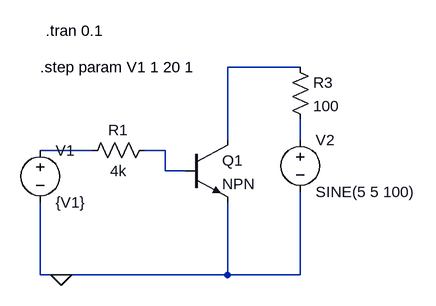
[diagram p0: schematic Draft17.asc]
Draft17.asc, the LTspice schematic file:
Version 4
SHEET 1 880 680
WIRE 576 144 464 144
WIRE 464 256 464 144
WIRE 576 256 576 224
WIRE 256 272 176 272
WIRE 368 272 336 272
WIRE 368 304 368 272
WIRE 400 304 368 304
WIRE 176 464 176 352
WIRE 208 464 176 464
WIRE 464 464 464 352
WIRE 464 464 208 464
WIRE 576 464 576 336
WIRE 576 464 464 464
FLAG 208 464 0
SYMBOL voltage 176 256 R0
SYMATTR InstName V1
SYMATTR Value {V1}
SYMBOL res 352 256 R90
WINDOW 0 0 56 VBottom 2
WINDOW 3 32 56 VTop 2
SYMATTR InstName R1
SYMATTR Value 4k
SYMBOL voltage 576 240 R0
SYMATTR InstName V2
SYMATTR Value SINE(5 5 100)
SYMBOL res 560 128 R0
SYMATTR InstName R3
SYMATTR Value 100
SYMBOL npn 400 256 R0
SYMATTR InstName Q1
TEXT 176 144 Left 2 !.step param V1 1 20 1
TEXT 184 88 Left 2 !.tran 0.1

The netlist it stands for:
* Draft17.asc
V1 N003 0 {V1}
R1 N004 N003 4k
V2 N002 0 SINE(5 5 100)
R3 N001 N002 100
Q1 N001 N004 0 0 NPN
.model NPN NPN
.model PNP PNP
.lib standard.bjt
.step param V1 1 20 1
.tran 0.1
.backanno
.end